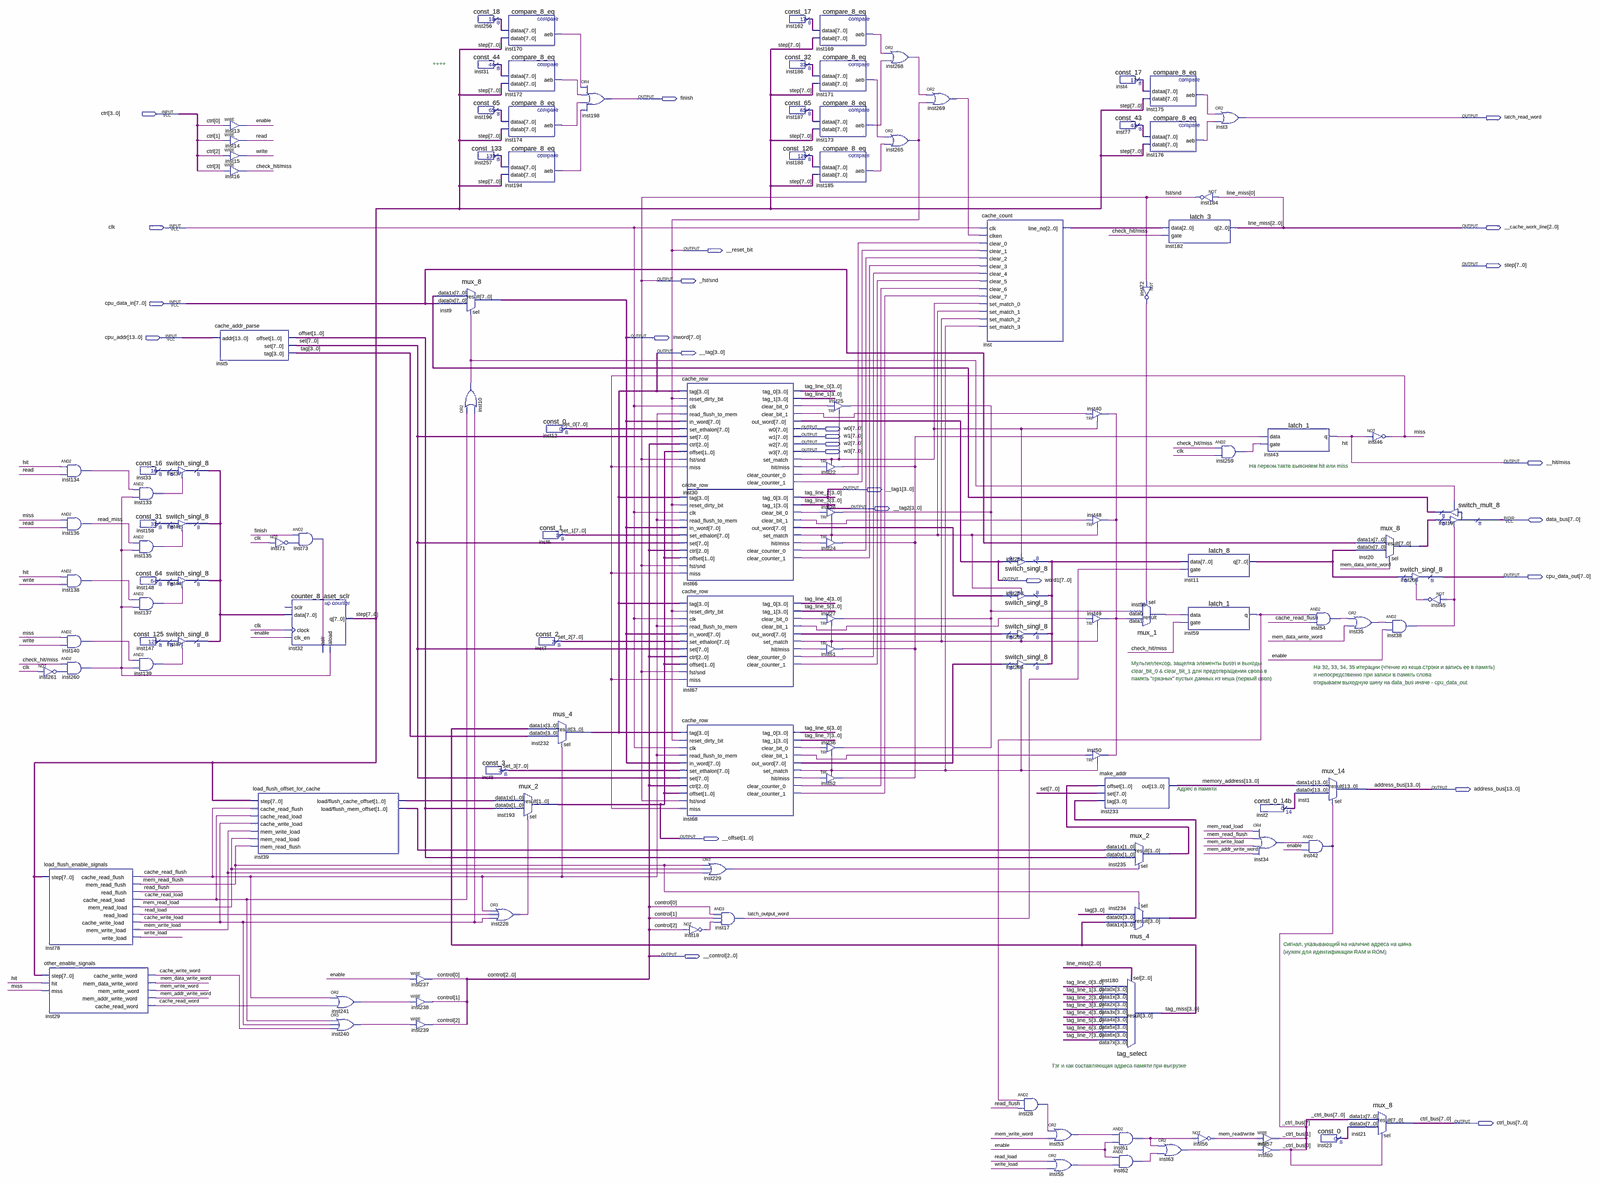
[diagram p0: schematic sheet, whole]
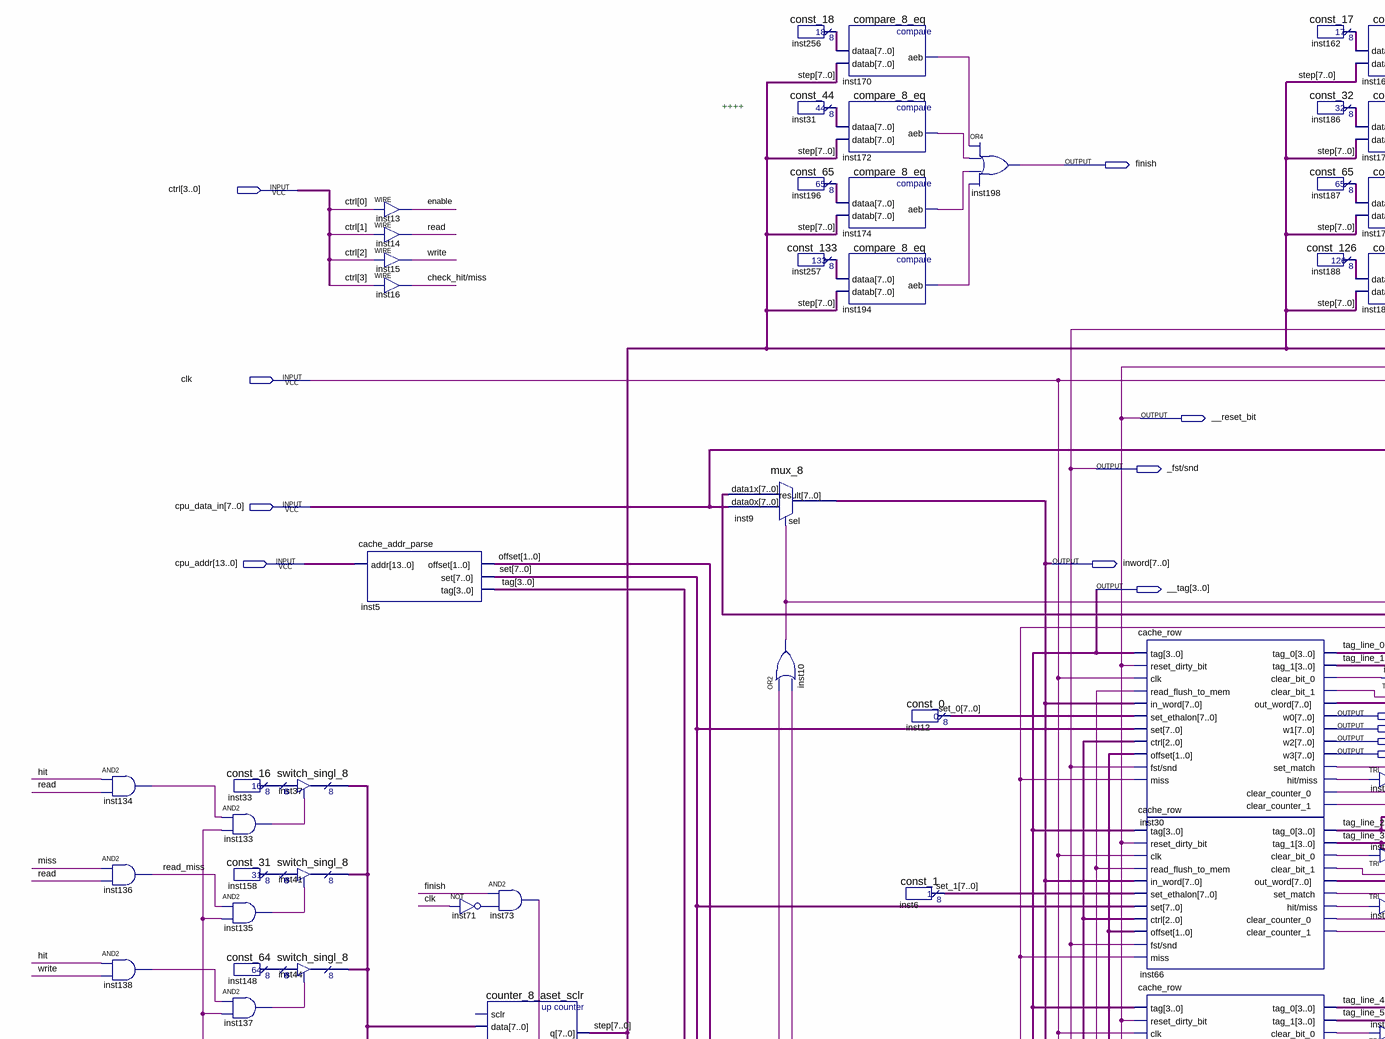
[diagram p1: schematic sheet, upper left part]
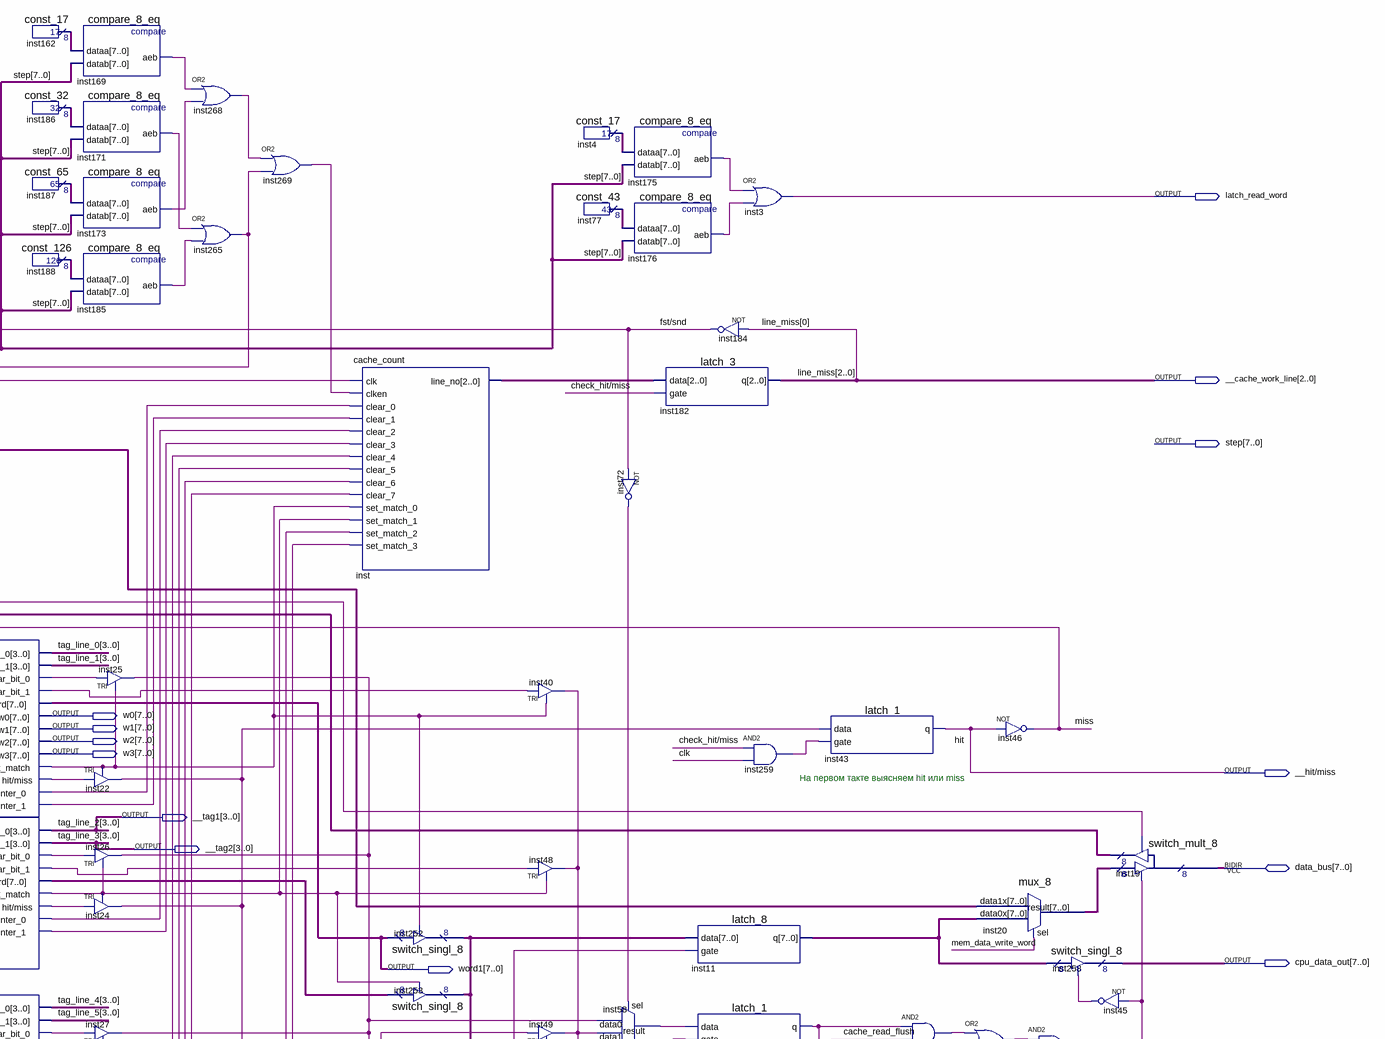
[diagram p2: schematic sheet, upper right part]
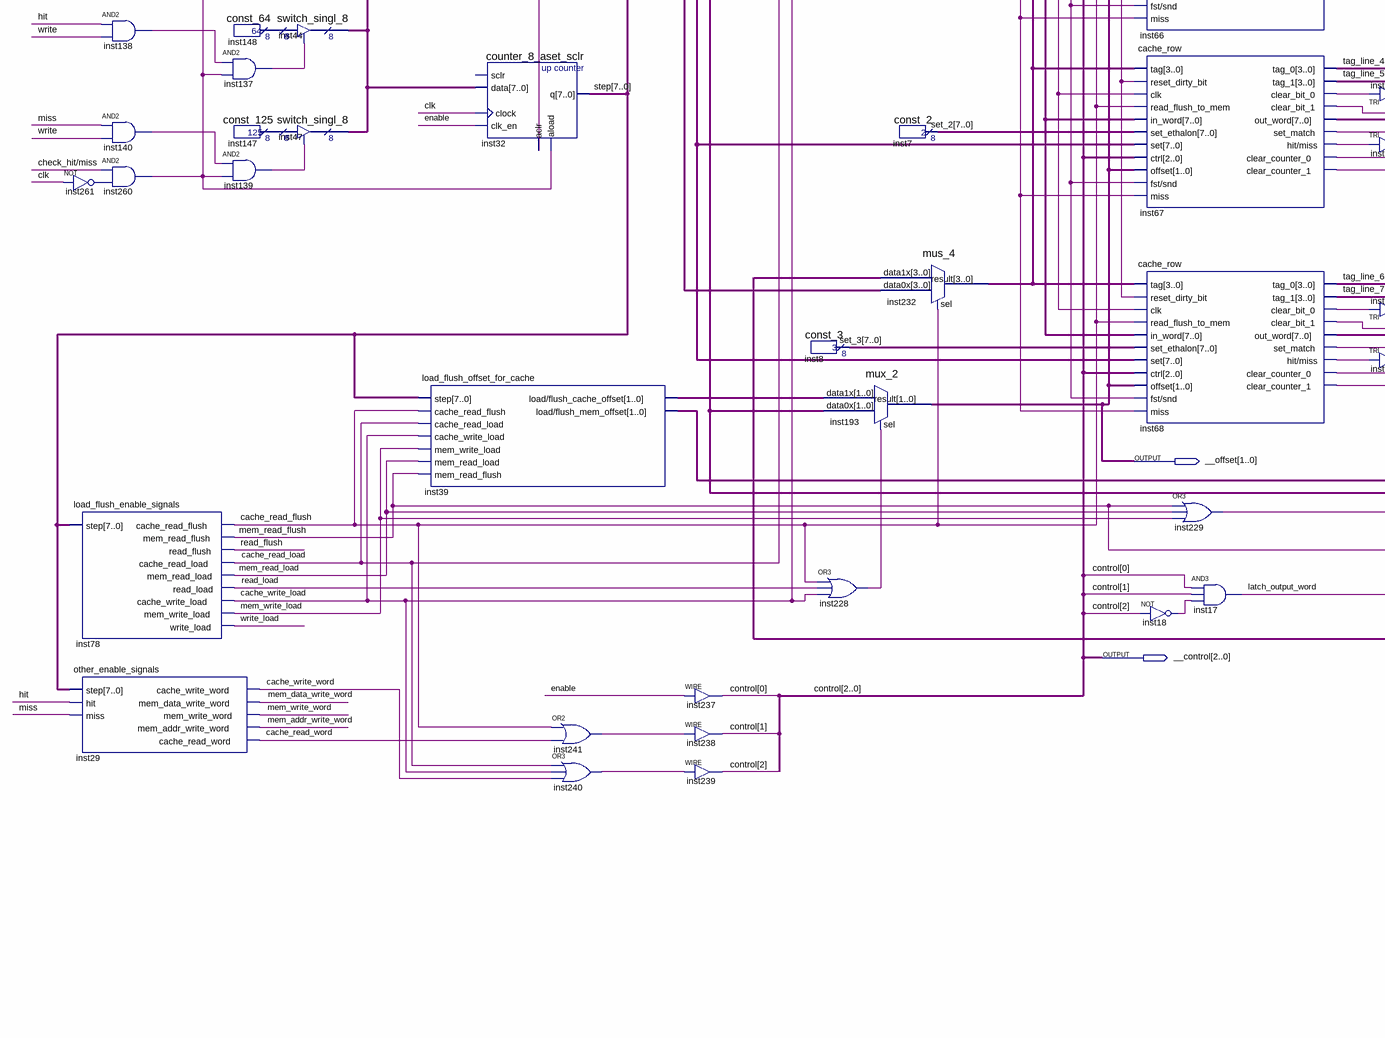
[diagram p3: schematic sheet, lower left part]
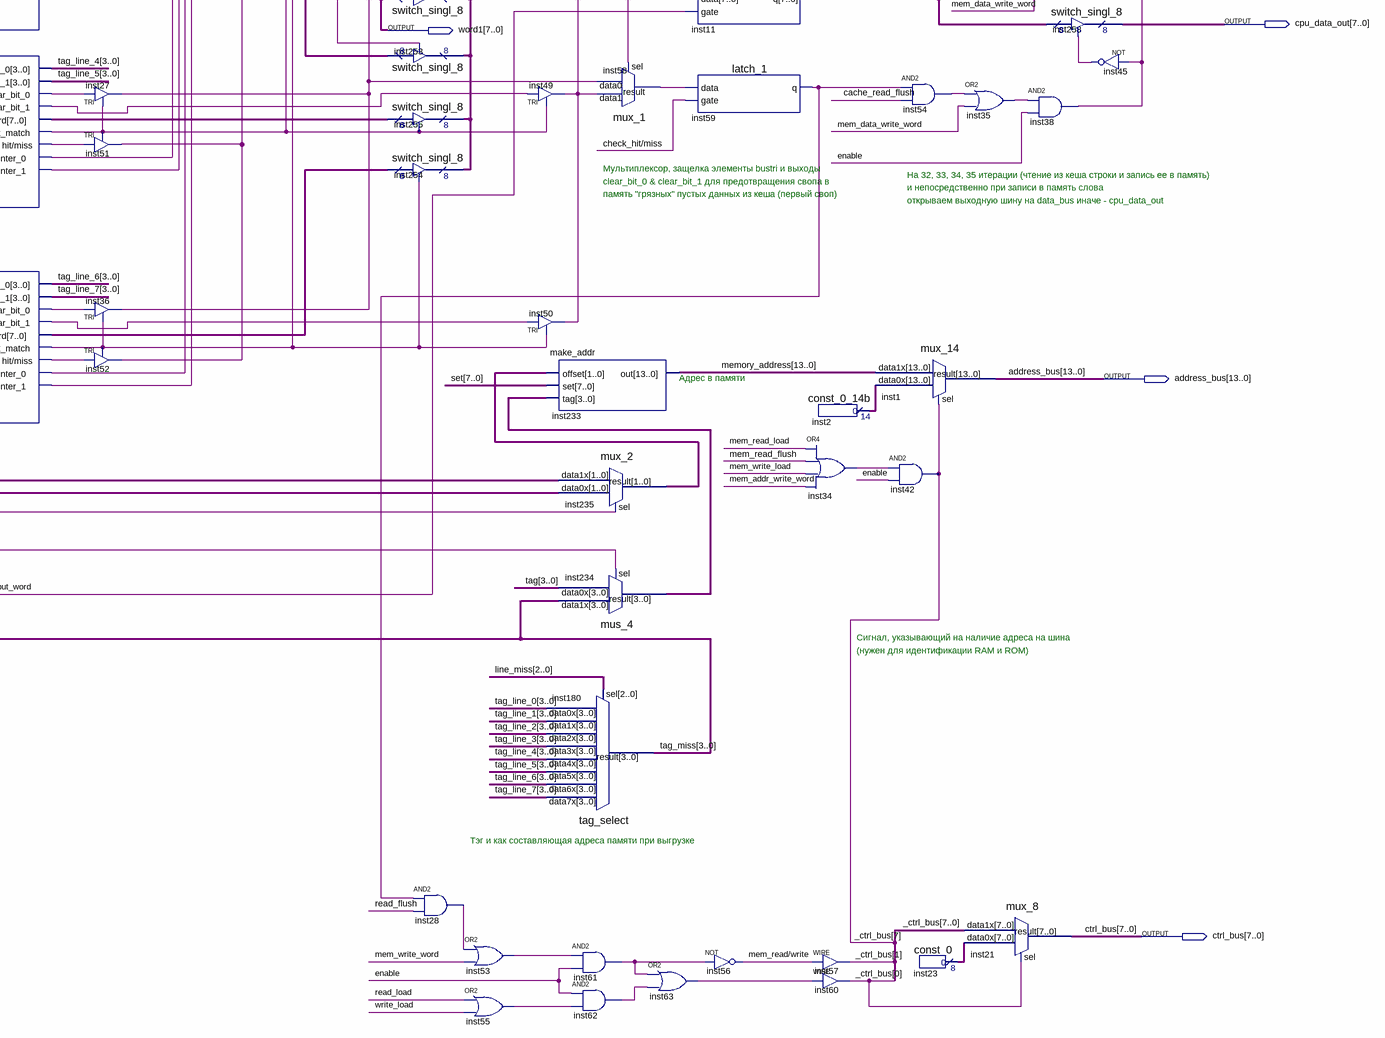
[diagram p4: schematic sheet, lower right part]
// Quartus schematic cache.bdf as structural Verilog: 127 symbols, 26 pins
module cache (
  input  [3:0] ctrl,
  input  clk,
  input  [7:0] cpu_data_in,
  input  [13:0] cpu_addr,
  inout  [7:0] data_bus,
  output finish,
  output latch_read_word,
  output [2:0] __cache_work_line,
  output __reset_bit,
  output [7:0] step,
  output \_fst/snd ,
  output [7:0] inword,
  output [3:0] __tag,
  output [7:0] w0,
  output [7:0] w1,
  output [7:0] w2,
  output [7:0] w3,
  output \__hit/miss ,
  output [3:0] __tag1,
  output [3:0] __tag2,
  output [7:0] cpu_data_out,
  output [7:0] word1,
  output [13:0] address_bus,
  output [1:0] __offset,
  output [2:0] __control,
  output [7:0] ctrl_bus
);

  wire cache_read_flush, cache_read_load, cache_read_word, cache_write_load, cache_write_word,
       \check_hit/miss , enable, inst10_out, inst18_out, inst22_out, inst26_out, inst28_out,
       inst30_clear_bit_0, inst30_clear_bit_1, inst30_clear_counter_0, inst30_clear_counter_1,
       inst30_hit_miss, inst30_set_match, inst34_out, inst35_out, inst38_out, inst40_out, inst45_out,
       inst53_out, inst54_out, inst55_out, inst58_result, inst59_q, inst61_out, inst62_out, inst63_out,
       inst66_clear_bit_0, inst66_clear_bit_1, inst66_clear_counter_0, inst66_clear_counter_1,
       inst66_hit_miss, inst66_set_match, inst67_clear_bit_0, inst67_clear_bit_1, inst67_clear_counter_0,
       inst67_clear_counter_1, inst67_hit_miss, inst67_set_match, inst68_clear_bit_0, inst68_clear_bit_1,
       inst68_clear_counter_0, inst68_clear_counter_1, inst68_hit_miss, inst68_set_match, inst71_out,
       inst72_out, inst73_out, inst133_out, inst134_out, inst135_out, inst137_out, inst138_out, inst139_out,
       inst140_out, inst169_aeb, inst170_aeb, inst171_aeb, inst172_aeb, inst173_aeb, inst174_aeb,
       inst175_aeb, inst176_aeb, inst185_aeb, inst194_aeb, inst228_out, inst229_out, inst240_out,
       inst241_out, inst259_out, inst260_out, inst261_out, inst268_out, inst269_out, latch_output_word,
       mem_addr_write_word, mem_data_write_word, \mem_read/write , mem_read_flush, mem_read_load,
       mem_write_load, mem_write_word, miss, read, read_flush, read_load, read_miss, write, write_load;
  wire [1:0] inst39_load_flush_cache_offset, inst39_load_flush_mem_offset, inst235_result, offset;
  wire [2:0] inst_line_no;
  wire [3:0] inst234_result, tag, tag_line_0, tag_line_1, tag_line_4, tag_line_5, tag_line_6, tag_line_7,
       tag_miss;
  wire [7:0] _ctrl_bus, inst4_result, inst11_q, inst19_result, inst20_result, inst23_result, inst31_result,
       inst33_result, inst37_tridata, inst66_out_word, inst67_out_word, inst68_out_word, inst77_result,
       inst147_result, inst148_result, inst158_result, inst162_result, inst186_result, inst187_result,
       inst188_result, inst196_result, inst252_tridata, inst256_result, inst257_result, set, set_0, set_1,
       set_2, set_3;
  wire [13:0] inst2_result, memory_address;

  and inst134 (inst134_out, \__hit/miss , read);
  and inst136 (read_miss, miss, read);
  and inst138 (inst138_out, \__hit/miss , write);
  and inst140 (inst140_out, miss, write);
  and inst260 (inst260_out, \check_hit/miss , inst261_out);
  not inst261 (inst261_out, clk);
  load_flush_enable_signals inst78 (
    .step(step), .cache_read_flush(cache_read_flush), .mem_read_flush(mem_read_flush),
    .read_flush(read_flush), .cache_read_load(cache_read_load), .mem_read_load(mem_read_load),
    .read_load(read_load), .cache_write_load(cache_write_load), .mem_write_load(mem_write_load),
    .write_load(write_load));
  other_enable_signals inst29 (
    .step(step), .hit(\__hit/miss ), .miss(miss), .cache_write_word(cache_write_word),
    .mem_data_write_word(mem_data_write_word), .mem_write_word(mem_write_word),
    .mem_addr_write_word(mem_addr_write_word), .cache_read_word(cache_read_word));
  const_16 inst33 (.result(inst33_result));
  and inst133 (inst133_out, inst134_out, inst260_out);
  const_31 inst158 (.result(inst158_result));
  and inst135 (inst135_out, read_miss, inst260_out);
  const_64 inst148 (.result(inst148_result));
  and inst137 (inst137_out, inst138_out, inst260_out);
  const_125 inst147 (.result(inst147_result));
  and inst139 (inst139_out, inst140_out, inst260_out);
  switch_singl_8 inst37 (.enabledt(inst133_out), .data(inst33_result), .tridata(inst37_tridata));
  switch_singl_8 inst41 (.enabledt(inst135_out), .data(inst158_result), .tridata(inst37_tridata));
  switch_singl_8 inst44 (.enabledt(inst137_out), .data(inst148_result), .tridata(inst37_tridata));
  switch_singl_8 inst47 (.enabledt(inst139_out), .data(inst147_result), .tridata(inst37_tridata));
  cache_addr_parse inst5 (.addr(cpu_addr), .offset(offset), .set(set), .tag(tag));
  assign enable = ctrl[0];  // WIRE inst13
  assign read = ctrl[1];  // WIRE inst14
  assign write = ctrl[2];  // WIRE inst15
  assign \check_hit/miss  = ctrl[3];  // WIRE inst16
  not inst71 (inst71_out, clk);
  load_flush_offset_for_cache inst39 (
    .step(step), .cache_read_flush(cache_read_flush), .cache_read_load(cache_read_load),
    .cache_write_load(cache_write_load), .mem_write_load(mem_write_load), .mem_read_load(mem_read_load),
    .mem_read_flush(mem_read_flush), .\load/flush_cache_offset (inst39_load_flush_cache_offset),
    .\load/flush_mem_offset (inst39_load_flush_mem_offset));
  and inst73 (inst73_out, finish, inst71_out);
  counter_8_aset_sclr inst32 (
    .data(inst37_tridata), .clock(clk), .clk_en(enable), .aclr(inst73_out), .aload(inst260_out), .q(step));  // open: sclr
  or inst241 (inst241_out, cache_read_flush, cache_read_word);
  or inst240 (inst240_out, cache_read_load, cache_write_load, cache_write_word);
  assign __control[0] = enable;  // WIRE inst237
  assign __control[1] = inst241_out;  // WIRE inst238
  assign __control[2] = inst240_out;  // WIRE inst239
  mux_8 inst9 (.data1x(inst19_result), .data0x(cpu_data_in), .sel(inst10_out), .result(inword));
  or inst10 (inst10_out, cache_read_load, cache_write_load);
  const_18 inst256 (.result(inst256_result));
  const_44 inst31 (.result(inst31_result));
  const_65 inst196 (.result(inst196_result));
  const_133 inst257 (.result(inst257_result));
  const_3 inst8 (.result(set_3));
  or inst228 (inst228_out, cache_read_flush, read_load, cache_write_load);
  compare_8_eq inst170 (.dataa(inst256_result), .datab(step), .aeb(inst170_aeb));
  compare_8_eq inst172 (.dataa(inst31_result), .datab(step), .aeb(inst172_aeb));
  compare_8_eq inst174 (.dataa(inst196_result), .datab(step), .aeb(inst174_aeb));
  compare_8_eq inst194 (.dataa(inst257_result), .datab(step), .aeb(inst194_aeb));
  mux_2 inst193 (.data1x(inst39_load_flush_cache_offset), .data0x(offset), .sel(inst228_out), .result(__offset));
  const_0 inst12 (.result(set_0));
  const_1 inst6 (.result(set_1));
  const_2 inst7 (.result(set_2));
  mus_4 inst232 (.data1x(tag_miss), .data0x(tag), .sel(cache_read_flush), .result(__tag));
  or inst198 (finish, inst170_aeb, inst172_aeb, inst174_aeb, inst194_aeb);
  cache_row inst30 (
    .tag(__tag), .reset_dirty_bit(__reset_bit), .clk(clk), .read_flush_to_mem(cache_read_flush),
    .in_word(inword), .set_ethalon(set_0), .set(set), .ctrl(__control), .offset(__offset),
    .\fst/snd (\_fst/snd ), .miss(miss), .tag_0(tag_line_0), .tag_1(tag_line_1),
    .clear_bit_0(inst30_clear_bit_0), .clear_bit_1(inst30_clear_bit_1), .out_word(word1), .w0(w0), .w1(w1),
    .w2(w2), .w3(w3), .set_match(inst30_set_match), .\hit/miss (inst30_hit_miss),
    .clear_counter_0(inst30_clear_counter_0), .clear_counter_1(inst30_clear_counter_1));
  cache_row inst66 (
    .tag(__tag), .reset_dirty_bit(__reset_bit), .clk(clk), .read_flush_to_mem(cache_read_flush),
    .in_word(inword), .set_ethalon(set_1), .set(set), .ctrl(__control), .offset(__offset),
    .\fst/snd (\_fst/snd ), .miss(miss), .tag_0(__tag1), .tag_1(__tag2), .clear_bit_0(inst66_clear_bit_0),
    .clear_bit_1(inst66_clear_bit_1), .out_word(inst66_out_word), .set_match(inst66_set_match),
    .\hit/miss (inst66_hit_miss), .clear_counter_0(inst66_clear_counter_0),
    .clear_counter_1(inst66_clear_counter_1));
  cache_row inst67 (
    .tag(__tag), .reset_dirty_bit(__reset_bit), .clk(clk), .read_flush_to_mem(cache_read_flush),
    .in_word(inword), .set_ethalon(set_2), .set(set), .ctrl(__control), .offset(__offset),
    .\fst/snd (\_fst/snd ), .miss(miss), .tag_0(tag_line_4), .tag_1(tag_line_5),
    .clear_bit_0(inst67_clear_bit_0), .clear_bit_1(inst67_clear_bit_1), .out_word(inst67_out_word),
    .set_match(inst67_set_match), .\hit/miss (inst67_hit_miss), .clear_counter_0(inst67_clear_counter_0),
    .clear_counter_1(inst67_clear_counter_1));
  cache_row inst68 (
    .tag(__tag), .reset_dirty_bit(__reset_bit), .clk(clk), .read_flush_to_mem(cache_read_flush),
    .in_word(inword), .set_ethalon(set_3), .set(set), .ctrl(__control), .offset(__offset),
    .\fst/snd (\_fst/snd ), .miss(miss), .tag_0(tag_line_6), .tag_1(tag_line_7),
    .clear_bit_0(inst68_clear_bit_0), .clear_bit_1(inst68_clear_bit_1), .out_word(inst68_out_word),
    .set_match(inst68_set_match), .\hit/miss (inst68_hit_miss), .clear_counter_0(inst68_clear_counter_0),
    .clear_counter_1(inst68_clear_counter_1));
  or inst229 (inst229_out, mem_read_flush, mem_read_load, mem_write_load);
  not inst18 (inst18_out, __control[2]);
  and inst17 (latch_output_word, __control[0], __control[1], inst18_out);
  const_17 inst162 (.result(inst162_result));
  const_32 inst186 (.result(inst186_result));
  const_65 inst187 (.result(inst187_result));
  const_126 inst188 (.result(inst188_result));
  compare_8_eq inst169 (.dataa(inst162_result), .datab(step), .aeb(inst169_aeb));
  compare_8_eq inst171 (.dataa(inst186_result), .datab(step), .aeb(inst171_aeb));
  compare_8_eq inst173 (.dataa(inst187_result), .datab(step), .aeb(inst173_aeb));
  compare_8_eq inst185 (.dataa(inst188_result), .datab(step), .aeb(inst185_aeb));
  TRI inst22 (.IN(inst30_hit_miss), .OE(inst30_set_match), .OUT(inst22_out));
  TRI inst26 (.IN(inst66_clear_bit_0), .OE(inst66_set_match), .OUT(inst26_out));
  TRI inst24 (.IN(inst66_hit_miss), .OE(inst66_set_match), .OUT(inst22_out));
  TRI inst27 (.IN(inst67_clear_bit_0), .OE(inst67_set_match), .OUT(inst26_out));
  TRI inst51 (.IN(inst67_hit_miss), .OE(inst67_set_match), .OUT(inst22_out));
  TRI inst36 (.IN(inst68_clear_bit_0), .OE(inst68_set_match), .OUT(inst26_out));
  TRI inst52 (.IN(inst68_hit_miss), .OE(inst68_set_match), .OUT(inst22_out));
  TRI inst25 (.IN(inst30_clear_bit_0), .OE(inst30_set_match), .OUT(inst26_out));
  or inst268 (inst268_out, inst169_aeb, inst173_aeb);
  or inst265 (__reset_bit, inst171_aeb, inst185_aeb);
  or inst269 (inst269_out, inst268_out, __reset_bit);
  cache_count inst (
    .clk(clk), .clken(inst269_out), .clear_0(inst30_clear_counter_0), .clear_1(inst30_clear_counter_1),
    .clear_2(inst66_clear_counter_0), .clear_3(inst66_clear_counter_1), .clear_4(inst67_clear_counter_0),
    .clear_5(inst67_clear_counter_1), .clear_6(inst68_clear_counter_0), .clear_7(inst68_clear_counter_1),
    .set_match_0(inst30_set_match), .set_match_1(inst66_set_match), .set_match_2(inst67_set_match),
    .set_match_3(inst68_set_match), .line_no(inst_line_no));
  switch_singl_8 inst252 (.enabledt(inst30_set_match), .data(word1), .tridata(inst252_tridata));
  switch_singl_8 inst253 (.enabledt(inst66_set_match), .data(inst66_out_word), .tridata(inst252_tridata));
  switch_singl_8 inst255 (.enabledt(inst67_set_match), .data(inst67_out_word), .tridata(inst252_tridata));
  switch_singl_8 inst254 (.enabledt(inst68_set_match), .data(inst68_out_word), .tridata(inst252_tridata));
  and inst28 (inst28_out, inst59_q, read_flush);
  or inst53 (inst53_out, inst28_out, mem_write_word);
  or inst55 (inst55_out, read_load, write_load);
  TRI inst40 (.IN(inst30_clear_bit_1), .OE(inst30_set_match), .OUT(inst40_out));
  TRI inst48 (.IN(inst66_clear_bit_1), .OE(inst66_set_match), .OUT(inst40_out));
  TRI inst49 (.IN(inst67_clear_bit_1), .OE(inst67_set_match), .OUT(inst40_out));
  TRI inst50 (.IN(inst68_clear_bit_1), .OE(inst68_set_match), .OUT(inst40_out));
  make_addr inst233 (.offset(inst235_result), .set(set), .tag(inst234_result), .out(memory_address));
  tag_select inst180 (
    .data7x(tag_line_7), .data6x(tag_line_6), .data5x(tag_line_5), .data4x(tag_line_4), .data3x(__tag2),
    .data2x(__tag1), .data1x(tag_line_1), .data0x(tag_line_0), .sel(__cache_work_line), .result(tag_miss));
  const_17 inst4 (.result(inst4_result));
  const_43 inst77 (.result(inst77_result));
  mux_1 inst58 (.data1(inst40_out), .data0(inst26_out), .sel(inst72_out), .result(inst58_result));
  mux_2 inst235 (.data1x(inst39_load_flush_mem_offset), .data0x(offset), .sel(inst229_out), .result(inst235_result));
  mus_4 inst234 (.data1x(tag_miss), .data0x(tag), .sel(mem_read_flush), .result(inst234_result));
  and inst61 (inst61_out, inst53_out, enable);
  and inst62 (inst62_out, enable, inst55_out);
  compare_8_eq inst175 (.dataa(inst4_result), .datab(step), .aeb(inst175_aeb));
  compare_8_eq inst176 (.dataa(inst77_result), .datab(step), .aeb(inst176_aeb));
  not inst72 (inst72_out, \_fst/snd );
  or inst63 (inst63_out, inst61_out, inst62_out);
  latch_3 inst182 (.data(inst_line_no), .gate(\check_hit/miss ), .q(__cache_work_line));
  latch_8 inst11 (.data(inst252_tridata), .gate(latch_output_word), .q(inst11_q));
  latch_1 inst59 (.data(inst58_result), .gate(\check_hit/miss ), .q(inst59_q));
  or inst3 (latch_read_word, inst175_aeb, inst176_aeb);
  not inst184 (\_fst/snd , __cache_work_line[0]);
  and inst259 (inst259_out, \check_hit/miss , clk);
  not inst56 (\mem_read/write , inst61_out);
  latch_1 inst43 (.data(inst22_out), .gate(inst259_out), .q(\__hit/miss ));
  const_0_14b inst2 (.result(inst2_result));
  or inst34 (inst34_out, mem_read_load, mem_read_flush, mem_write_load, mem_addr_write_word);
  assign _ctrl_bus[1] = \mem_read/write ;  // WIRE inst57
  assign _ctrl_bus[0] = inst63_out;  // WIRE inst60
  and inst54 (inst54_out, inst59_q, cache_read_flush);
  mux_14 inst1 (.data1x(memory_address), .data0x(inst2_result), .sel(_ctrl_bus[7]), .result(address_bus));
  and inst42 (_ctrl_bus[7], inst34_out, enable);
  const_0 inst23 (.result(inst23_result));
  not inst46 (miss, \__hit/miss );
  mux_8 inst20 (.data1x(cpu_data_in), .data0x(inst11_q), .sel(mem_data_write_word), .result(inst20_result));
  or inst35 (inst35_out, inst54_out, mem_data_write_word);
  mux_8 inst21 (.data1x(_ctrl_bus), .data0x(inst23_result), .sel(_ctrl_bus[0]), .result(ctrl_bus));
  switch_singl_8 inst258 (.enabledt(inst45_out), .data(inst11_q), .tridata(cpu_data_out));
  and inst38 (inst38_out, inst35_out, enable);
  not inst45 (inst45_out, inst38_out);
  switch_mult_8 inst19 (
    .enabledt(inst38_out), .data(inst20_result), .enabletr(inst10_out), .result(inst19_result),
    .tridata(data_bus));

  // Other names for the same wires on the sheet: control[2:0] = __control; fst/snd = \_fst/snd ; hit = \__hit/miss ;
  //   line_miss[2:0] = __cache_work_line; tag_line_2[3:0] = __tag1; tag_line_3[3:0] = __tag2

  // Notes on the sheet:
  //   ++++
  //   На первом такте выясняем hit или miss
  //   Мультиплексор, защелка элементы bustri и выходы
  //   На 32, 33, 34, 35 итерации (чтение из кеша строки и запись ее в память)
  //   clear_bit_0 & clear_bit_1 для предотвращения свопа в
  //   и непосредственно при записи в память слова
  //   память "грязных" пустых данных из кеша (первый своп)
  //   открываем выходную шину на data_bus иначе - cpu_data_out
  //   Адрес в памяти
  //   Сигнал, указывающий на наличие адреса на шина
  //   (нужен для идентификации RAM и ROM)
  //   Тэг и как составляющая адреса памяти при выгрузке
endmodule
